# EasyEDA schematic Mini Quadcopter_2020-08-14_18-30-40.json
TITLE: Sheet_1; REV: 1.0; Date: 2020-07-14; Sheet: 1/1; Drawn By: Kendrick; Company: Your Company
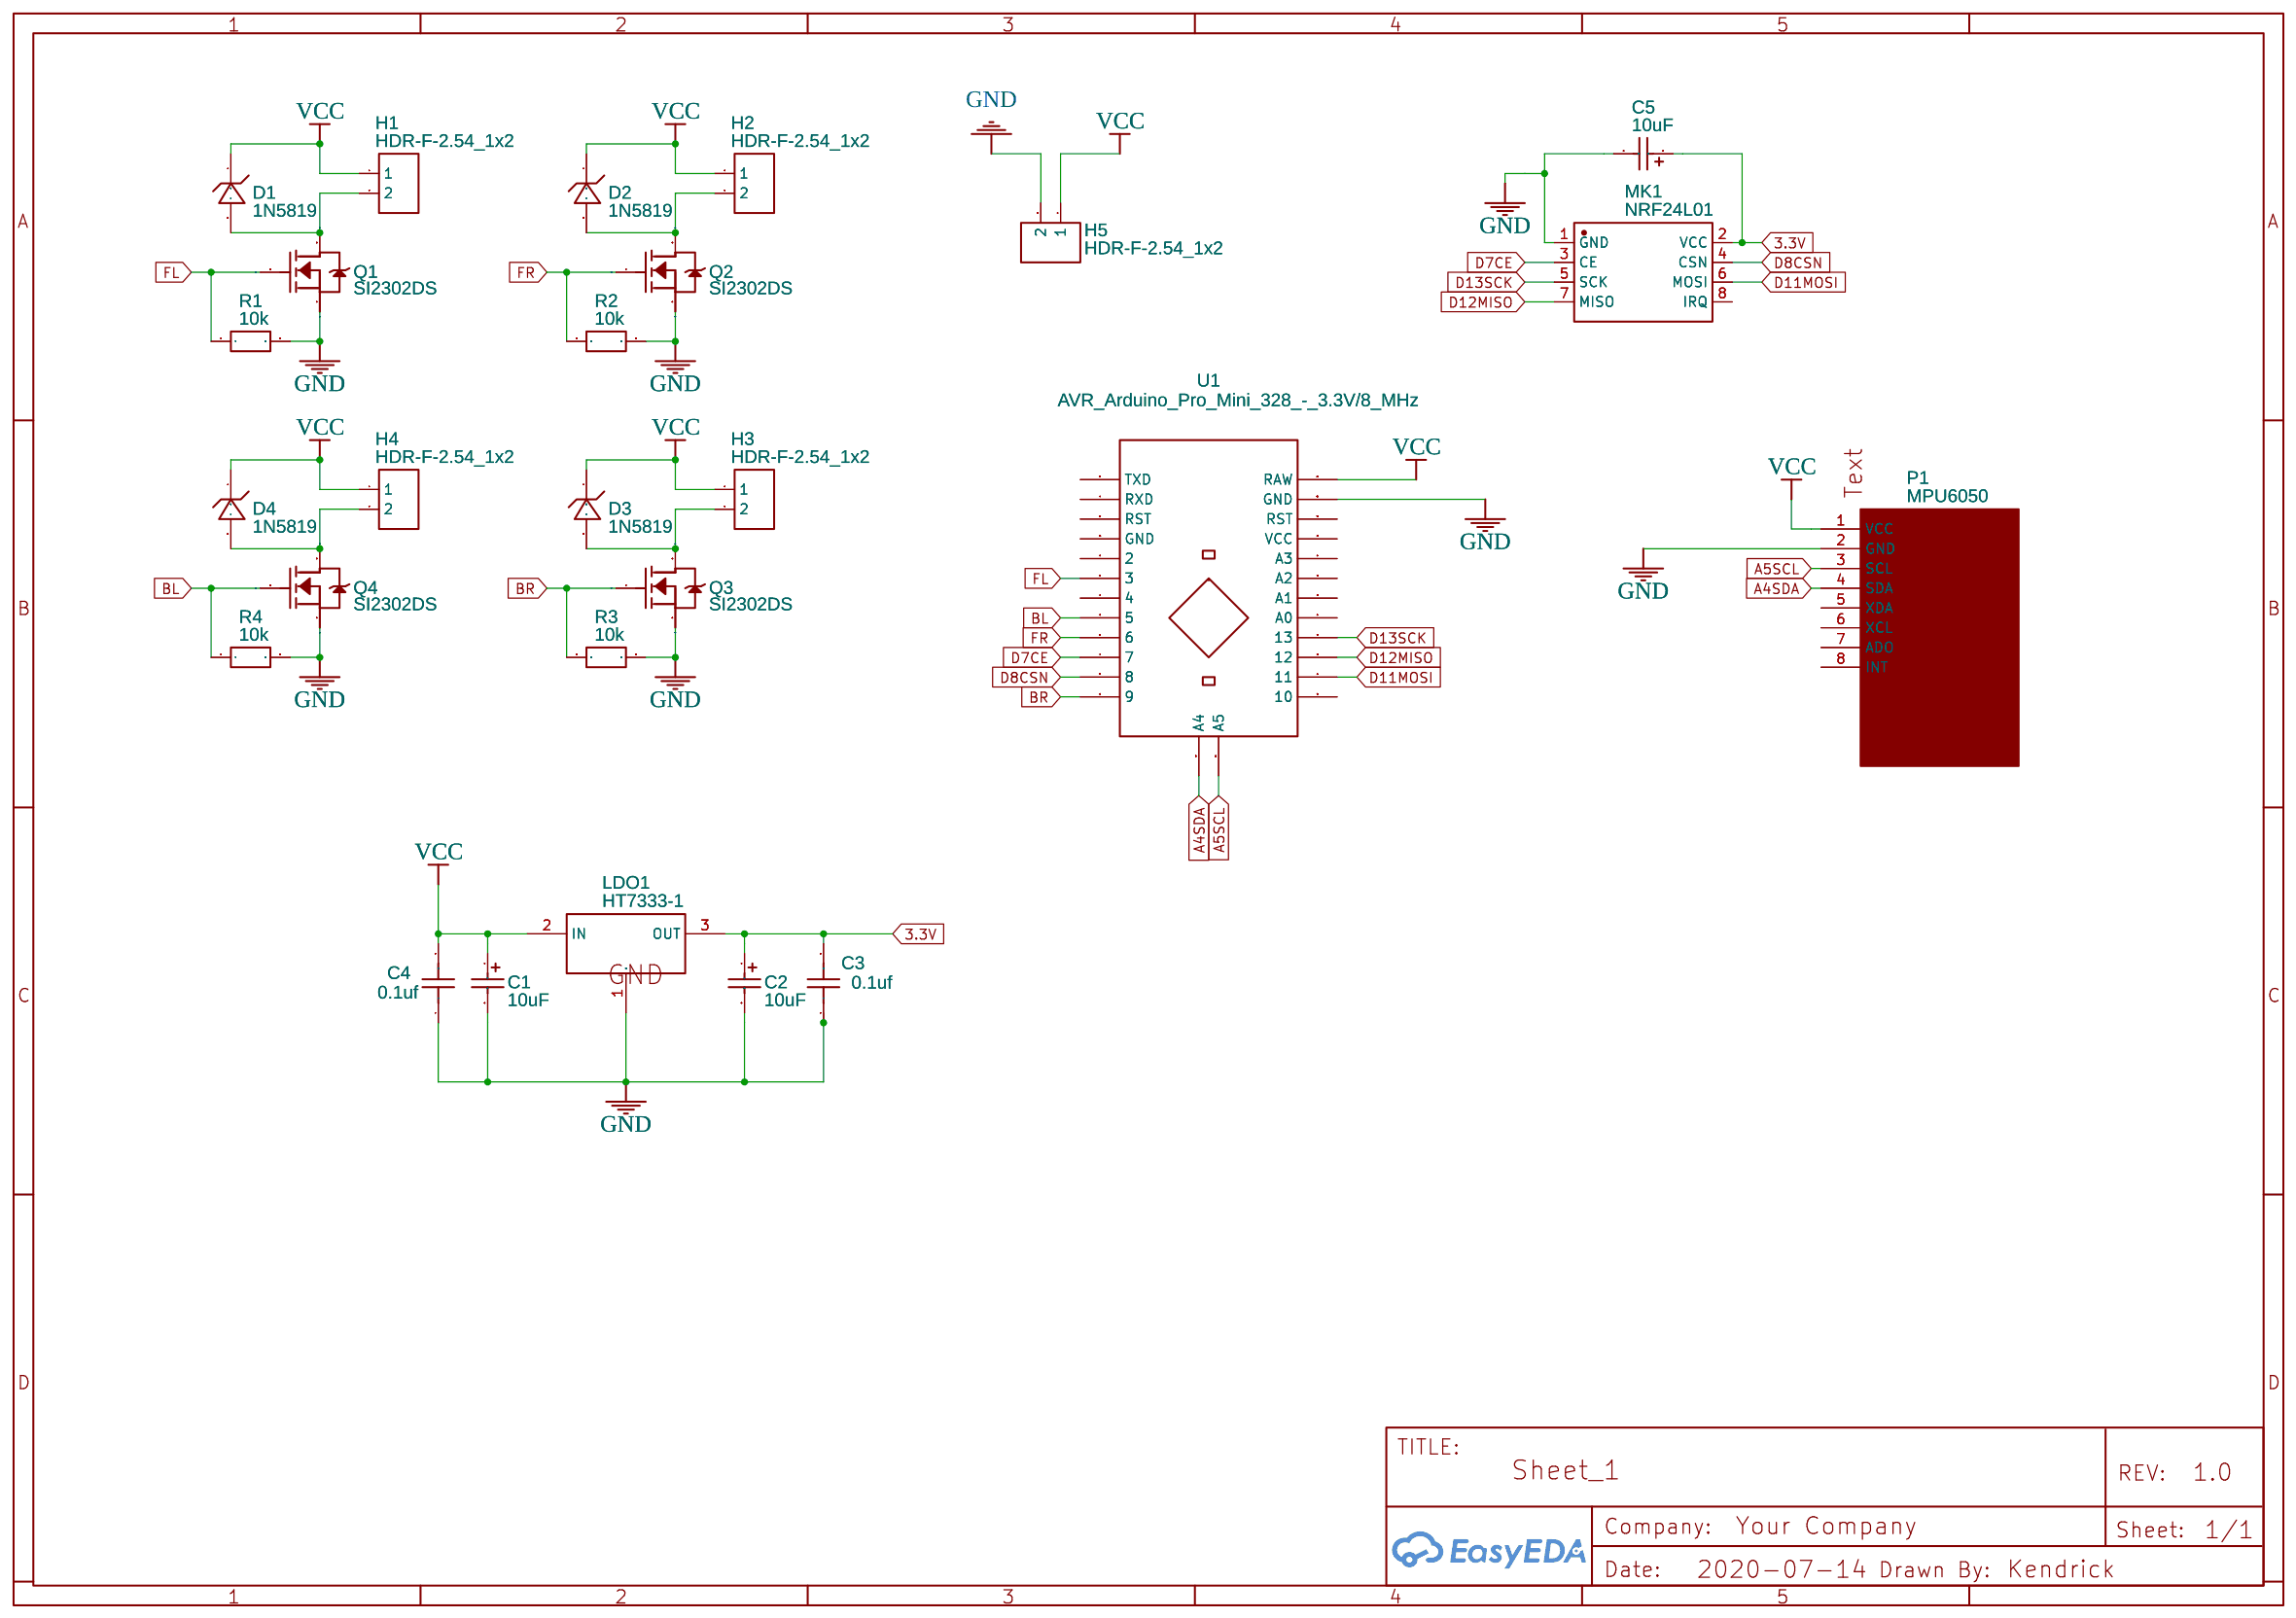
[diagram p0: schematic sheet]

## Parts
C1  10uF  [CAP-SMD_L3.5-W2.8-R-RD]
C2  10uF  [CAP-SMD_L3.5-W2.8-R-RD]
C3  0.1uf  [C0603]
C4  0.1uf  [C0603]
C5  10uF  [CAP-SMD_L3.5-W2.8-R-RD]
D1  1N5819  [DO-41_BD2.4-L4.7-P8.70-D0.9-RD]
D2  1N5819  [DO-41_BD2.4-L4.7-P8.70-D0.9-RD]
D3  1N5819  [DO-41_BD2.4-L4.7-P8.70-D0.9-RD]
D4  1N5819  [DO-41_BD2.4-L4.7-P8.70-D0.9-RD]
H1  HDR-F-2.54_1x2  [HDR-F-2.54_1X2]
H2  HDR-F-2.54_1x2  [HDR-F-2.54_1X2]
H3  HDR-F-2.54_1x2  [HDR-F-2.54_1X2]
H4  HDR-F-2.54_1x2  [HDR-F-2.54_1X2]
H5  HDR-F-2.54_1x2  [HDR-F-2.54_1X2]
LDO1  HT7333-1  [SOT-89-3_L4.5-W2.5-P1.50-LS4.2-BR]
MK1  NRF24L01  [WIRELM-SMD_NRF24L01]
P1  MPU6050  [MPU6050]
Q1  SI2302DS  [SOT-23-3_L2.9-W1.3-P1.90-LS2.4-BR]
Q2  SI2302DS  [SOT-23-3_L2.9-W1.3-P1.90-LS2.4-BR]
Q3  SI2302DS  [SOT-23-3_L2.9-W1.3-P1.90-LS2.4-BR]
Q4  SI2302DS  [SOT-23-3_L2.9-W1.3-P1.90-LS2.4-BR]
R1  10k  [R0603]
R2  10k  [R0603]
R3  10k  [R0603]
R4  10k  [R0603]
U1  AVR_Arduino_Pro_Mini_328_-_3.3V/8_MHz  [AVR ARDUINO PRO MINI 328 - 3.3V/8 MHZ_FOOTPRINT]

## Library data of the parts
C1 C2 C5 = CA45A-B-16V-10UF-K: Supplier: LCSC; Manufacturer: CEC; Supplier Part: C141741; LCSC Assembly: Yes; SMT Type: Extend
C3 C4 = C_0603_US: Contributor: LCEDA_Lib
D1-D4 = 1N5819_C402218: Supplier: LCSC; Supplier Part: C402218; Manufacturer: LGE; Contributor: LCSC
H1-H5 = HDR-F-2.54_1x2: Supplier Part: C49661; Supplier: LCSC; Contributor: LCEDA_Lib
LDO1 = HT7333-1: Supplier: LCSC; Manufacturer: HOLTEK; Supplier Part: C77777; LCSC Assembly: Yes; SMT Type: Extend
MK1 = NRF24L01: Supplier: LCSC; Manufacturer: Ai-Thinker; Manufacturer Part: NRF24L01+功率加强版绑定2.4Gwireless module; Supplier Part: C90751
P1 = MPU6050: sourceId: 1T5FDZYC8
Q1-Q4 = SI2302DS-T1-GE3: Supplier: LCSC; Supplier Part: C558245; Manufacturer: VBsemi Elec; Contributor: LCSC
R1-R4 = R_0603_EU: Contributor: LCEDA_Lib
U1 = AVR_Arduino_Pro_Mini_328_-_3.3V/8_MHz: Manufacturer Part: AVR Arduino Pro Mini 328 - 3.3V/8 MHz; Supplier Part: 485-2377; Supplier: Mouser; link: https://www.mouser.de/ProductDetail/485-2377?r=485-2377; Contributor: ishtiaq1ahmed

## Nets
3.3V: C2.1 C3.2 C5.1 LDO1.3(OUT) MK1.2(VCC)
GND: C1.2 C2.2 C3.1 C4.1 C5.2 H5.2 LDO1.1(GND) MK1.1(GND) P1.2(GND) Q1.2(S) Q2.2(S) Q3.2(S) Q4.2(S) R1.2 R2.2 R3.2 R4.2 U1.GND
VCC: C1.1 C4.2 D1.1(C) D2.1(C) D3.1(C) D4.1(C) H1.1 H2.1 H3.1 H4.1 H5.1 LDO1.2(IN) P1.1(VCC) U1.RAW
A4SDA: P1.4(SDA) U1.18(A4)
A5SCL: P1.3(SCL) U1.19(A5)
BL: Q4.1(G) R4.1 U1.5
BR: Q3.1(G) R3.1 U1.9
D7CE: MK1.3(CE) U1.7
D8CSN: MK1.4(CSN) U1.8
D11MOSI: MK1.6(MOSI) U1.11
D12MISO: MK1.7(MISO) U1.12
D13SCK: MK1.5(SCK) U1.13
FL: Q1.1(G) R1.1 U1.3
FR: Q2.1(G) R2.1 U1.6
Net-(D1-2): D1.2(A) H1.2 Q1.3(D)
Net-(D2-2): D2.2(A) H2.2 Q2.3(D)
Net-(D3-2): D3.2(A) H3.2 Q3.3(D)
Net-(D4-2): D4.2(A) H4.2 Q4.3(D)

Not connected (* = marked no-connect by the designer): MK1 8(IRQ); P1 5(XDA) 6(XCL) 7(ADO) 8(INT); U1 0(TXD) 1(RXD) 2 4 10 14(A0) 15(A1) 16(A2) 17(A3) RST VCC
